# Altium schematic sheet Low Pass Filter.SchDoc
size A
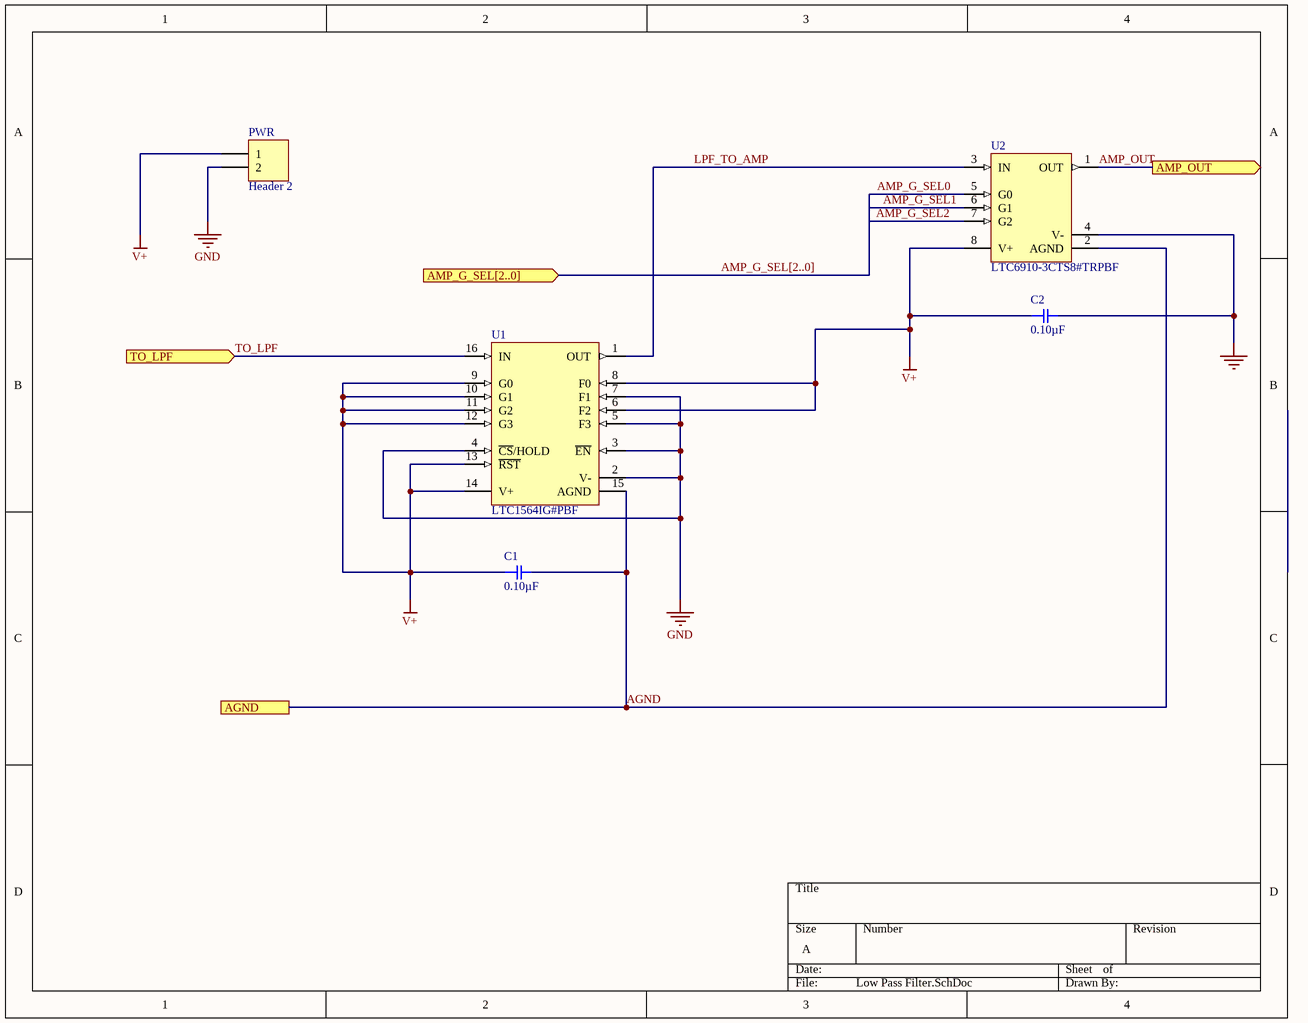
[diagram p0: Low Pass Filter.SchDoc]

## Parts
C1  0.10µF  [SMD-0805C]
C2  0.10µF  [SMD-0805C]
PWR  Header 2  [HDR1X2]
U1  LTC1564IG#PBF  [LT-G-16_M]
U2  LTC6910-3CTS8#TRPBF  [LT-TS8-8-TSOT-23_V]

## Ports
AGND, AMP_G_SEL[2..0] (in), AMP_OUT (out), TO_LPF (in)

## Nets
GND: C2.2 PWR.2 U1.2(V-) U1.3(~{EN}) U1.4(~{CS}/HOLD) U1.5(F3) U1.7(F1) U2.4(V-)
V+: C1.1 C2.1 PWR.1 U1.6(F2) U1.8(F0) U1.9(G0) U1.10(G1) U1.11(G2) U1.12(G3) U1.13(~{RST}) U1.14(V+) U2.8(V+)
AGND: C1.2 U1.15(AGND) U2.2(AGND) ; port AGND
AMP_G_SEL0: U2.5(G0)
AMP_G_SEL1: U2.6(G1)
AMP_G_SEL2: U2.7(G2)
AMP_OUT: U2.1(OUT) ; port AMP_OUT
LPF_TO_AMP: U1.1(OUT) U2.3(IN)
TO_LPF: U1.16(IN) ; port TO_LPF

## Buses and harness runs
bus AMP_G_SEL[2..0] = port AMP_G_SEL[2..0]

## Library data of the parts
C1 C2 = GCD21BR71H104KA01L: CAP CER 0.1UF 50V X7R 0805; Manufacturer: Murata Electronics North America; Factory Stock: 0; Unit Price (USD): 0.24; Minimum Quantity: 1; Tolerance: ±10%; Datasheets: http://www.murata.com/~/media/webrenewal/support/library/catalog/products/capacitor/mlcc/c03e.ashx; Image: //media.digikey.com/Renders/Murata%20Renders/0805%28GxM6%29.jpg; Digi-Key Part Number: 490-11955-1-ND; Part Number: GCD21BR71H104KA01L; Quantity Available: 157; @ qty: 0; Packaging: Cut Tape (CT); Series: GCD; Part Status: Active; Value: 0.10µF; Voltage: 50V; Temperature Coefficient: X7R; Operating Temperature: -55°C ~ 125°C; Features: -; Ratings: AEC-Q200; Applications: Automotive; Mounting Type: Surface Mount, MLCC; Package / Case: 0805 (2012 Metric); Size / Dimension: 0.079" L x 0.049" W (2.00mm x 1.25mm); Height - Seated (Max): -; Thickness (Max): 0.049" (1.25mm); Lead Spacing: -; Lead Style: -
PWR = Header 2: Header, 2-Pin; LatestRevisionDate: 17-Jul-2002; LatestRevisionNote: Re-released for DXP Platform.; Publisher: Altium Limited
U1 = CMP-0359-00059-2: Single Channel, Digitally Controlled Antialiasing Filter and 4-Bit PGA, 0.15 MHz Typical GBW, 2.7 to 10.5 V, 16-Pin SOP (G16), Industrial, Pb-Free; Manufacturer: Linear Technology; Vs Max (V): 10.5; GBW (MHz) Typical: 0.15; Is (mA) Typical: 15; Channels (#): 1; Vos (mV) Typical: 3; Vs Min (V): 2.7; ComponentLink1Description: Manufacturer URL; ComponentLink2URL: http://cds.linear.com/docs/en/datasheet/1564fa.pdf; ComponentLink1URL: http://www.linear.com/; PackageReference: LT-G-16; Mounting Technology: Surface Mount; ComponentLink3URL: http://cds.linear.com/docs/en/packaging/SSOP_16_05-08-1640.pdf; Linear Technology Part Number: LTC1564; DatasheetVersion: Rev. A; Type: PGA; ComponentLink2Description: Datasheet; RoHS: Pb-Free; ComponentLink3Description: Package Specification; PackageDescription: 16-Lead Plastic SSOP, Body 6.2 x 5.3 mm, Pitch 0.65 mm; PartNumber: LTC1564IG#PBF; RevisionNote: URLs updated
U2 = CMP-0359-03721-2: Single Channel, Digitally Controlled Programmable Gain Amplifier, 11 MHz Typical GBW, 16 V/us Typical SR, 2.7 to 11 V, 8-Pin SOT23 (TS8-8), Commercial, Pb-Free, Reel; Manufacturer: Linear Technology; Channels (#): 1; Vos (mV) Typical: 3; Vs Min (V): 2.7; GBW (MHz) Typical: 11; SR (V/us) Typical: 16; Is (mA) Typical: 2; PartNumber: LTC6910-3CTS8#TRPBF; DatasheetVersion: Rev. A; PackageVersion: Rev A; ComponentLink2Description: Datasheet; ComponentLink3Description: Package Specification; PackageReference: LT-TS8-8-TSOT-23; Mounting Technology: Surface Mount; ComponentLink1Description: Manufacturer URL; Linear Technology Part Number: LTC6910-3; Packing: Reel; ComponentLink1URL: http://www.linear.com/; RevisionNote: URLs updated; RoHS: Pb-Free; Vs Max (V): 11; Code_JEDEC: MO-193; Type: PGA; ComponentLink3URL: http://cds.linear.com/docs/en/packaging/SOT_8_05-08-1637.pdf; PackageDescription: 8-Lead Plastic TSOT-23, Body 2.9 x 1.63 mm, Pitch 0.65 mm; ComponentLink2URL: http://cds.linear.com/docs/en/datasheet/6910123fa.pdf